# EAGLE schematic xbee_2017 (EAGLE 7.7.0)
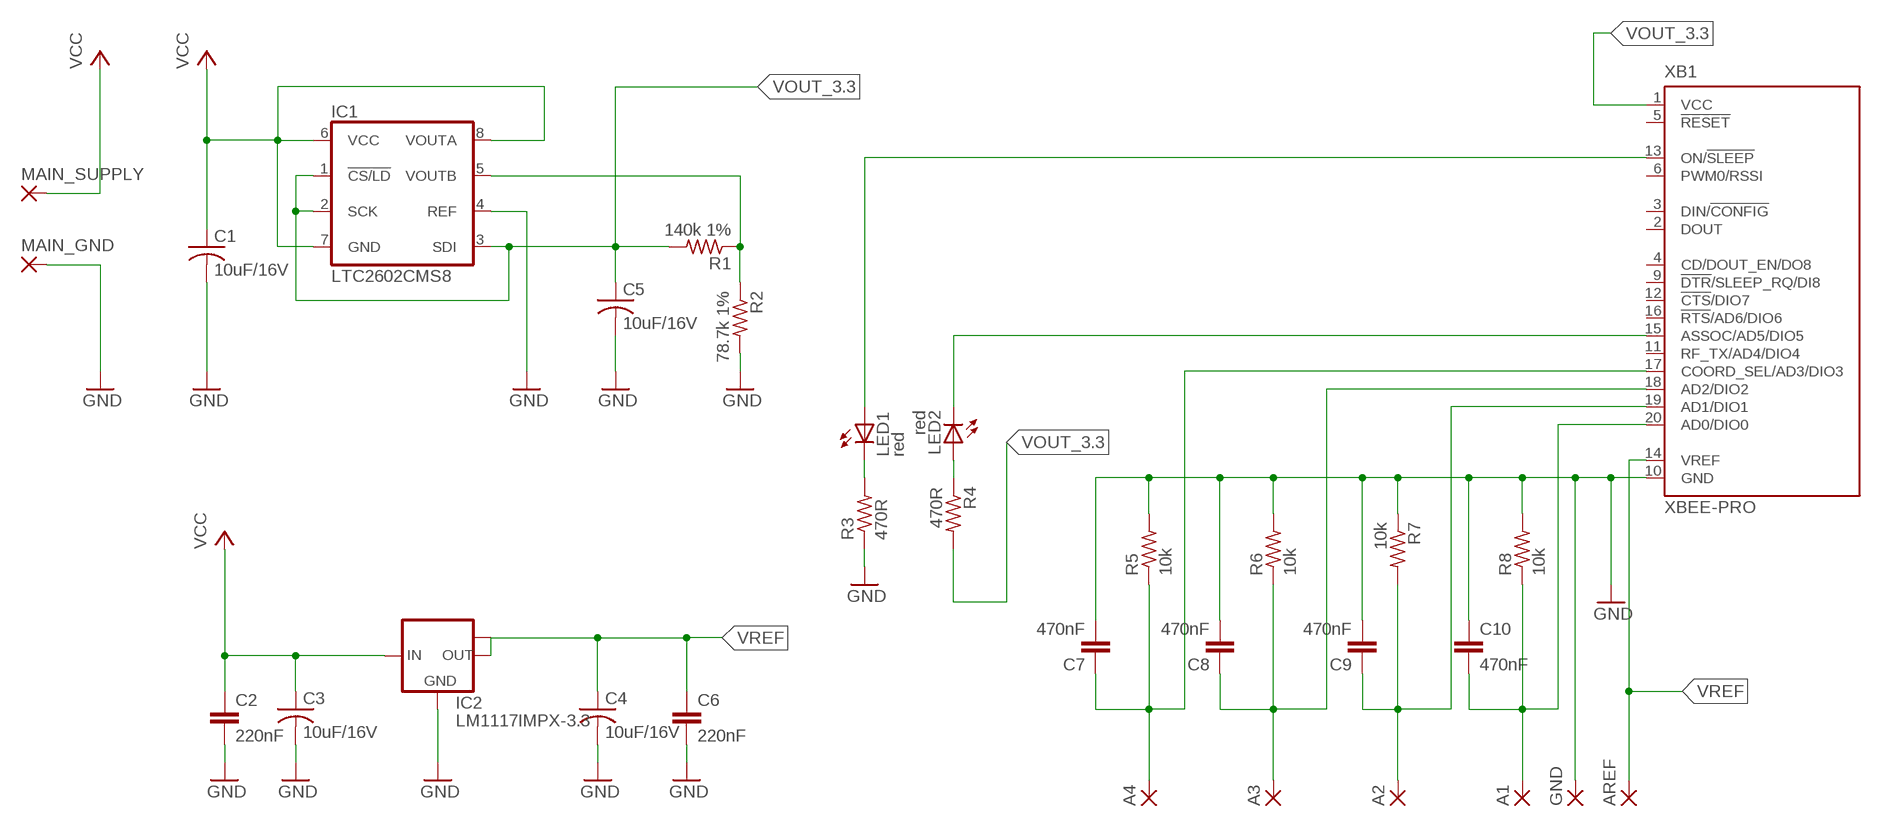
[diagram p0: schematic, sheet 1]

## Parts
A1  2,54/0,9  [2,54/0,9]
A2  2,54/0,9  [2,54/0,9]
A3  2,54/0,9  [2,54/0,9]
A4  2,54/0,9  [2,54/0,9]
AREF  2,54/0,9  [2,54/0,9]
C1  10uF/16V  C-US025-030X050  [C025-030X050]
C2  220nF  C-EU025-025X050  [C025-025X050]
C3  10uF/16V  C-US025-030X050  [C025-030X050]
C4  10uF/16V  C-US025-030X050  [C025-030X050]
C5  10uF/16V  C-US025-030X050  [C025-030X050]
C6  220nF  C-EU025-025X050  [C025-025X050]
C7  470nF  C5/2.5  [C5B2.5]
C8  470nF  C5/2.5  [C5B2.5]
C9  470nF  C5/2.5  [C5B2.5]
C10  470nF  C5/2.5  [C5B2.5]
GND  2,54/0,9  [2,54/0,9]
IC1  LTC2602CMS8  [MSOP8]
IC2  LM1117IMPX-3.3  [SOT223]
LED1  red  LED3MM  [LED3MM]
LED2  red  LED3MM  [LED3MM]
MAIN_GND  3,17/1,3  [3,17/1,3]
MAIN_SUPPLY  3,17/1,3  [3,17/1,3]
R1  140k 1%  R-US_0207/10  [0207/10]
R2  78.7k 1%  R-US_0207/10  [0207/10]
R3  470R  R-US_0207/10  [0207/10]
R4  470R  R-US_0207/10  [0207/10]
R5  10k  R-US_0207/10  [0207/10]
R6  10k  R-US_0207/10  [0207/10]
R7  10k  R-US_0207/10  [0207/10]
R8  10k  R-US_0207/10  [0207/10]
XB1  XBEE-PRO  [XBEE-PRO]

## Nets
GND: C1.2 C2.2 C3.2 C4.2 C5.2 C6.2 C7.2 C8.2 C9.2 C10.1 GND.1(P) IC1.4(REF) IC2.1(GND) MAIN_GND.1(P) R2.2 R3.1 R5.2 R6.2 R7.1 R8.2 XB1.10(GND)
N$1: IC1.5(VOUTB) R1.1 R2.1
N$3: LED1.K(C) R3.2
N$4: LED2.A R4.1
N$5: LED2.K(C) XB1.15(ASSOC/AD5/DIO5)
N$6: LED1.A XB1.13(ON/!SLEEP)
N$7: A3.1(P) C8.1 R6.1 XB1.18(AD2/DIO2)
N$9: A4.1(P) C7.1 R5.1 XB1.17(COORD_SEL/AD3/DIO3)
N$10: A1.1(P) C10.2 R8.1 XB1.20(AD0/DIO0)
N$11: A2.1(P) C9.1 R7.2 XB1.19(AD1/DIO1)
VCC: C1.1 C2.1 C3.1 IC1.6(VCC) IC1.7(GND) IC1.8(VOUTA) IC2.3(IN) MAIN_SUPPLY.1(P)
VOUT_3.3: C5.1 IC1.1(!CS/LD) IC1.2(SCK) IC1.3(SDI) R1.2 R4.2 XB1.1(VCC)
VREF: AREF.1(P) C4.1 C6.1 IC2.2(OUT) IC2.TAB(OUT1) XB1.14(VREF)
Unconnected: XB1.2(DOUT) XB1.3(DIN/!CONFIG) XB1.4(CD/DOUT_EN/DO8) XB1.5(!RESET) XB1.6(PWM0/RSSI) XB1.9(!DTR!/SLEEP_RQ/DI8) XB1.11(RF_TX/AD4/DIO4) XB1.12(!CTS!/DIO7) XB1.16(!RTS!/AD6/DIO6)

## Library data of the parts
A1-A4 AREF GND = wirepad:2,54/0,9: THROUGH-HOLE PAD
C1 C3-C5 = resistor:C-US: CAPACITOR, American symbol
C2 C6 = resistor:C-EU: CAPACITOR, European symbol
C7-C10 = capacitor-wima:C: CAPACITOR naming: grid - package width
IC1 = linear-technology:LTC26*: Dual 16-/14-/12-Bit Rail-to-Rail DACs Source: www.linear.com; MPN: LTC2602CMS8; OC_FARNELL: 1330944; OC_NEWARK: 56M5818
IC2 = lm1117:LM1117IMPX-*
LED1 LED2 = led:LED: LED OSRAM: - CHIPLED LG R971, LG N971, LY N971, LG Q971, LY Q971, LO R971, LY R971 LH N974, LH R974 LS Q976, LO Q976, LY Q976 LO Q996 - Hyper CHIPLED LW Q18S LB Q993, LB Q99A, LB R99A - SideLED LS A670, LO A670, LY A670, LG A670, LP A670 LB A673, LV A673, LT A673, LW A673 LH A674 LY A675 LS A676, LA A676, LO A676, LY A676, LW A676 LS A679, LY A679, LG A679 - Hyper Micro SIDELED® LS Y876, LA Y876, LO Y876, LY Y876 LT Y87S - SmartLED LW L88C, LW L88S LB L89C, LB L89S, LG L890 LS L89K, LO L89K, LY L89K LS L896, LA L896, LO L896, LY L896 - TOPLED LS T670, LO T670, LY T670, LG T670, LP T670 LSG T670, LSP T670, LSY T670, LOP T670, LYG T670 LG T671, LOG T671, LSG T671 LB T673, LV T673, LT T673, LW T673 LH T674 LS T676, LA T676, LO T676, LY T676, LB T676, LH T676, LSB T676, LW T676 LB T67C, LV T67C, LT T67C, LS T67K, LO T67K, LY T67K, LW E67C LS E67B, LA E67B, LO E67B, LY E67B, LB E67C, LV E67C, LT E67C LW T67C LS T679, LY T679, LG T679 LS T770, LO T770, LY T770, LG T770, LP T770 LB T773, LV T773, LT T773, LW T773 LH T774 LS E675, LA E675, LY E675, LS T675 LS T776, LA T776, LO T776, LY T776, LB T776 LHGB T686 LT T68C, LB T68C - Hyper Mini TOPLED® LB M676 - Mini TOPLED Santana® LG M470 LS M47K, LO M47K, LY M47K Source: http://www.osram.convergy.de LUXEON: - LUMILED® LXK2-PW12-R00, LXK2-PW12-S00, LXK2-PW14-U00, LXK2-PW14-V00 LXK2-PM12-R00, LXK2-PM12-S00, LXK2-PM14-U00 LXK2-PE12-Q00, LXK2-PE12-R00, LXK2-PE12-S00, LXK2-PE14-T00, LXK2-PE14-U00 LXK2-PB12-K00, LXK2-PB12-L00, LXK2-PB12-M00, LXK2-PB14-N00, LXK2-PB14-P00, LXK2-PB14-Q00 LXK2-PR12-L00, LXK2-PR12-M00, LXK2-PR14-Q00, LXK2-PR14-R00 LXK2-PD12-Q00, LXK2-PD12-R00, LXK2-PD12-S00 LXK2-PH12-R00, LXK2-PH12-S00 LXK2-PL12-P00, LXK2-PL12-Q00, LXK2-PL12-R00 Source: www.luxeon.com KINGBRIGHT: KA-3528ASYC Source: www.kingbright.com
MAIN_GND MAIN_SUPPLY = wirepad:3,17/1,3: THROUGH-HOLE PAD
R1-R8 = resistor:R-US_: RESISTOR, American symbol
XB1 = maxstream:XBEE: XBee (TM) /XBee-PRO(TM) OEM RF Modules Source: MaxStream, Inc. xbee_productmanual.pdf; MPN: XBP24-AWI-001; OC_FARNELL: 1337916; OC_NEWARK: 42M2667

## Net classes
0 default: width 0.305 mm, drill 0.508 mm, clearance 0.254 mm